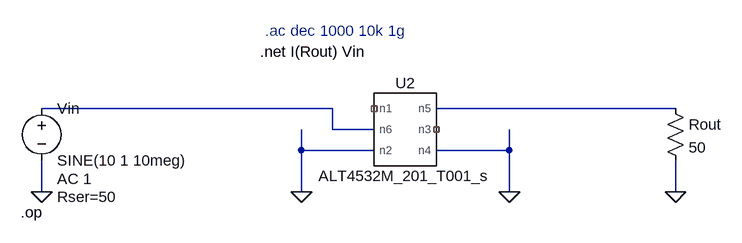
[diagram p0: schematic ETH_trafo_S21.asc]
ETH_trafo_S21.asc, the LTspice schematic file:
Version 4.1
SHEET 1 880 680
WIRE -128 112 -576 112
WIRE 400 112 32 112
WIRE -128 144 -128 112
WIRE -64 144 -128 144
WIRE -176 176 -176 144
WIRE -64 176 -176 176
WIRE 144 176 144 144
WIRE 144 176 32 176
WIRE -576 240 -576 192
WIRE -176 240 -176 176
WIRE 144 240 144 176
WIRE 400 240 400 192
FLAG -576 240 0
FLAG 400 240 0
FLAG -176 240 0
FLAG 144 240 0
DATAFLAG 288 112 ""
DATAFLAG -208 112 ""
SYMBOL voltage -576 96 R0
WINDOW 123 24 124 Left 2
WINDOW 39 24 152 Left 2
SYMATTR Value2 AC 1
SYMATTR SpiceLine Rser=50
SYMATTR InstName Vin
SYMATTR Value SINE(10 1 10meg)
SYMBOL res 384 96 R0
SYMATTR InstName Rout
SYMATTR Value 50
SYMBOL ALT4532M_201_T001_s -16 144 R0
SYMATTR InstName U2
TEXT -240 24 Left 2 !.net I(Rout) Vin
TEXT -232 -8 Left 2 ;.ac dec 1000 10k 1g
TEXT -608 272 Left 2 !.op

The netlist it stands for:
* ETH_trafo_S21.asc
Vin N001 0 SINE(10 1 10meg) AC 1 Rser=50
Rout N002 0 50
X§U2 NC_01 0 NC_02 0 N002 N001 ALT4532M_201_T001_s  ; pins n1 n2 n3 n4 n5 n6
.net I(Rout) Vin
* .ac dec 1000 10k 1g
.op
.lib alt4532m_201_t001_s.mod.cir
.backanno
.end